# Altium schematic sheet TVS_4Ch_bidirectional.SchDoc
size A4; CompanyName: Technische Hochschule Nürnberg Georg Simon Ohm; Organization: UltraZohm; Address1: Kesslerplatz 12; Address2: 90489 Nürnberg; Address3: GERMANY; Website: www.ultrazohm.com
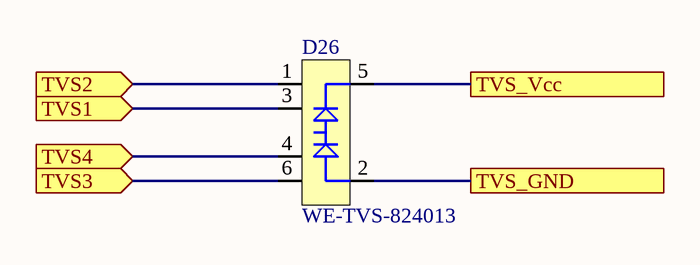
[diagram p0: TVS_4Ch_bidirectional.SchDoc]

## Parts
D26  WE-TVS-824013  [SOT95P280X145-6N]

## Ports
TVS1 (in), TVS2 (in), TVS3 (in), TVS4 (in), TVS_GND, TVS_Vcc

## Nets
TVS1: D26.3(I/O2) ; port TVS1
TVS2: D26.1(I/O1) ; port TVS2
TVS3: D26.6(I/O4) ; port TVS3
TVS4: D26.4(I/O3) ; port TVS4
TVS_GND: D26.2(GND) ; port TVS_GND
TVS_Vcc: D26.5(VDD) ; port TVS_Vcc

## Notes on the sheet
- Title
- Revision:
- Design Engineer:
- Date:
- Project:
- Sheet
- of

## Library data of the parts
D26 = 23986: TVS/Clamp Diode Array 3.3/9V Quad SOT23-6; AN: 23986; Mixed: SMT; Trenz-Stock: Yes; H-ART: 824013; Extra: ESD Protection for 4 lines, Low capacitance; Case: SOT23-6; HelpURL: B:\AD\adlib\datasheet\WE-TVS-824013; Preferred: Yes